# Altium schematic sheet Opto_outputs.SchDoc
size A4; SheetNumber: 6; SheetTotal: 8
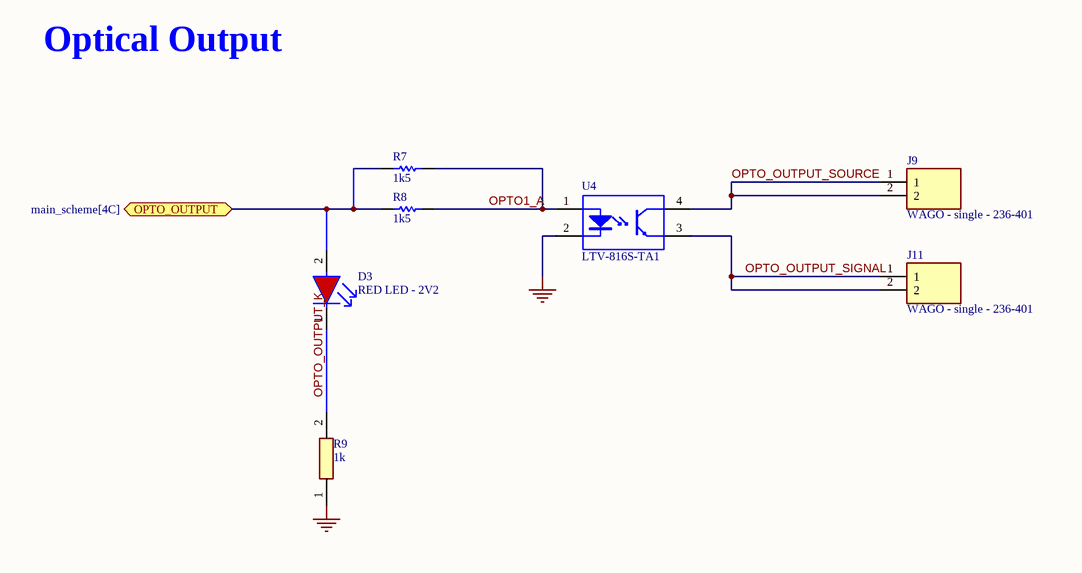
[diagram p0: Opto_outputs.SchDoc]

## Parts
D3  RED LED - 2V2  [0603_RED_LED]
J9  WAGO - single - 236-401  [WAGO-236-601]
J11  WAGO - single - 236-401  [WAGO-236-601]
R7  1k5  [RESC1005X40X25NL05T05]
R8  1k5  [RESC1005X40X25NL05T05]
R9  1k  [0603- SMD resistor]
U4  LTV-816S-TA1  [LTST-LTV-816S_V]

## Ports
OPTO_OUTPUT (bidir, see main_scheme[4C])

## Nets
GND: R9.1 U4.2(CATHODE)
OPTO1_A: R7.2 R8.2 U4.1(ANODE)
OPTO_OUTPUT: D3.2(A) R7.1 R8.1 ; port OPTO_OUTPUT
OPTO_OUTPUT_K: D3.1(C) R9.2
OPTO_OUTPUT_SIGNAL: J11.1 J11.2 U4.3(EMITTER)
OPTO_OUTPUT_SOURCE: J9.1 J9.2 U4.4(COLLECTOR)

## Notes on the sheet
- Optical Output

## Library data of the parts
D3 = LED - 0603 - RED - 2V2: LED RED DIFFUSED 0603 SMD; PartNumber: SML-D12U1WT86; Value: RED LED - 2.2V; Package: 0602; ComponentLink1Description: myLinks; ComponentLink1URL: https://cz.mouser.com/ProductDetail/ROHM-Semiconductor/SML-D12U1WT86?qs=M3jcYzEJUdEySuGkbjHEtQ%3D%3D; Supplier 1: Mouser; Supplier Part Number 1: 755-SML-D12U1WT86
J9 J11 = WAGO - single - 236-401: Wago connector - PCB to wire - single - 24A 320V; ComponentLink1Description: myLinks; ComponentLink1URL: https://cz.farnell.com/wago/236-401/terminal-block-wire-to-brd-1pos/dp/1891620?gclid=CjwKCAiAu5agBhBzEiwAdiR5tFj9uwuLgrlShO914YuSUEtsU0o4Hiox7ZjRnpSnFBbtyRYLbKYJWxoC0xgQAvD_BwE&mckv=sEoohdYPd_dc|pcrid|263733373421|kword|+wago%20+236-401|match|b|plid||slid||product||pgrid|56870816529|ptaid|kwd-298399736559|&CMP=KNC-GCZ-GEN-SKU-MDC; Value: 24A 320V; Package: 236-401; PartNumber: 236-401; Supplier 1: Farnell; Supplier Part Number 1: 1891620
R7 R8 = Resistor - 0402 - 1k5: Resistor - 0402 - 1k5 - 1% - 100mW; PartNumber: ERJ-2RKF1501X; Value: 1k5; Package: 0402; ComponentLink1Description: myLinks; ComponentLink1URL: https://cz.mouser.com/ProductDetail/Panasonic/ERJ-2RKF1501X?qs=sGAEpiMZZMtG0KNrPCHnjTg0x5DoQJ5PTwSSYoQ29R0%3D; Supplier 1: Mouser; Supplier Part Number 1: 667-ERJ-2RKF1501X
R9 = RESISTOR - 0603 - 1k: Resistor 0603 1KR 100mW 1%; PartNumber: RT0603FRE071KL; ComponentLink1Description: myLinks; ComponentLink1URL: https://cz.mouser.com/ProductDetail/YAGEO/RT0603FRE071KL?qs=8cPjvKtxWv68ZVEzoi6JxQ%3D%3D; Value: 1k; Package: 0603; Supplier 1: Mouser; Supplier Part Number 1: 603-RT0603FRE071KL
U4 = OPTO - 50mA - 80V: Photocoupler, 50 mA, -30 to 110 degC, 4-Pin SMD, RoHS, Tape and Reel; Value: output 80V 50mA, Input  1.2V; ComponentLink1Description: myLinks; ComponentLink1URL: https://cz.mouser.com/ProductDetail/Lite-On/LTV-816S-TA1?qs=gnaPJ2cis715Sm%2FgFsy6%2FQ%3D%3D; PartNumber: LTV-816S-TA1; Package: PDIP-4 Gull Wing; Supplier 1: Mouser; Supplier Part Number 1: 859-LTV-816S-TA1